# Altium schematic sheet OPAMP_TESTER_2.SchDoc: OPAMP_TESTER
size A4; CheckedBy: D.MOHAMMADI; DrawnBy: A.RAJABI; SheetNumber: 3; SheetTotal: 3
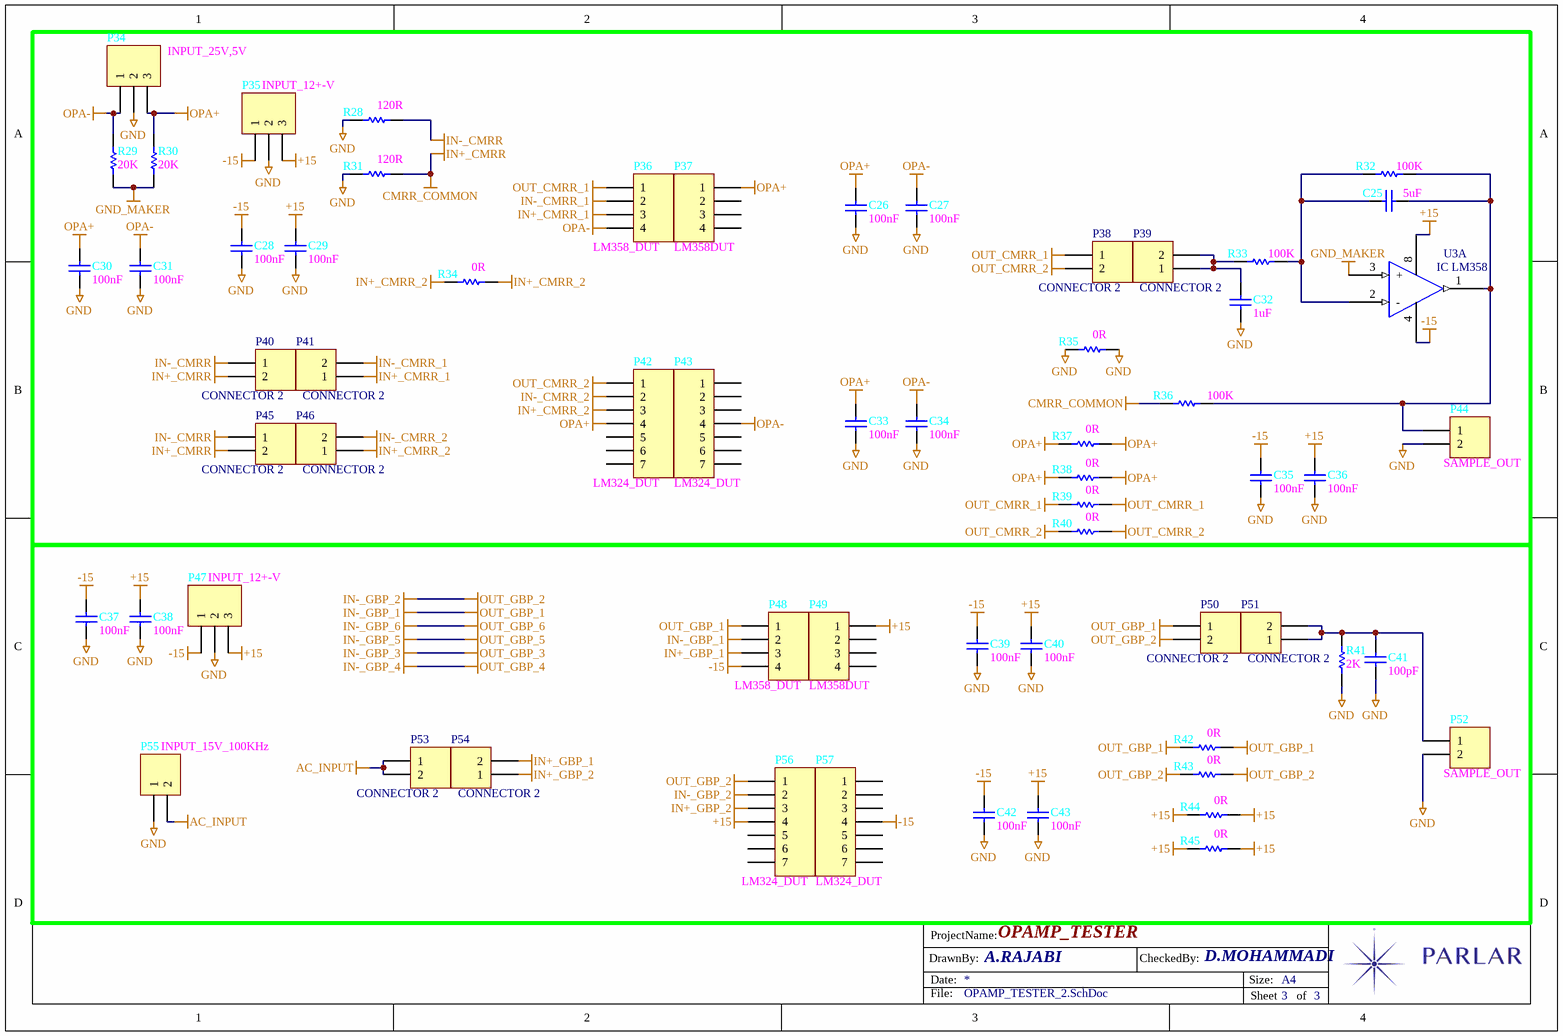
[diagram p0: OPAMP_TESTER_2.SchDoc]

## Parts
C25  5uF  [SMD 1206]
C26  100nF  [SMD 1206]
C27  100nF  [SMD 0805]
C28  100nF  [SMD 0805]
C29  100nF  [SMD 0805]
C30  100nF  [SMD 0805]
C31  100nF  [SMD 0805]
C32  1uF  [SMD 0805]
C33  100nF  [SMD 1206]
C34  100nF  [SMD 0805]
C35  100nF  [SMD 0805]
C36  100nF  [SMD 0805]
C37  100nF  [SMD 0805]
C38  100nF  [SMD 0805]
C39  100nF  [SMD 0805]
C40  100nF  [SMD 0805]
C41  100pF  [SMD 0805]
C42  100nF  [SMD 0805]
C43  100nF  [SMD 1206]
P34  INPUT_25V,5V  [CON XH 3]
P35  INPUT_12+-V  [CON XH 3]
P36  LM358_DUT  [CON HDR 2.54FM 4]
P37  LM358DUT  [CON HDR 2.54FM 4]
P38  CONNECTOR 2  [CON HDR 2.54M 2]
P39  CONNECTOR 2  [CON HDR 2.54M 2]
P40  CONNECTOR 2  [CON HDR 2.54M 2]
P41  CONNECTOR 2  [CON HDR 2.54M 2]
P42  LM324_DUT  [CON HDR 2.54FM 7]
P43  LM324_DUT  [CON HDR 2.54FM 7]
P44  SAMPLE_OUT  [CON XH 2]
P45  CONNECTOR 2  [CON HDR 2.54M 2]
P46  CONNECTOR 2  [CON HDR 2.54M 2]
P47  INPUT_12+-V  [CON XH 3]
P48  LM358_DUT  [CON HDR 2.54FM 4]
P49  LM358DUT  [CON HDR 2.54FM 4]
P50  CONNECTOR 2  [CON HDR 2.54M 2]
P51  CONNECTOR 2  [CON HDR 2.54M 2]
P52  SAMPLE_OUT  [CON XH 2]
P53  CONNECTOR 2  [CON HDR 2.54M 2]
P54  CONNECTOR 2  [CON HDR 2.54M 2]
P55  INPUT_15V_100KHz  [CON XH 2]
P56  LM324_DUT  [CON HDR 2.54FM 7]
P57  LM324_DUT  [CON HDR 2.54FM 7]
R28  120R  [SMD 0805]
R29  20K  [SMD 1206]
R30  20K  [SMD 0805]
R31  120R  [SMD 1206]
R32  100K  [SMD 0805]
R33  100K  [SMD 1206]
R34  0R  [SMD 1206]
R35  0R  [SMD 1206]
R36  100K  [SMD 1206]
R37  0R  [SMD 1206]
R38  0R  [SMD 1206]
R39  0R  [SMD 1206]
R40  0R  [SMD 1206]
R41  2K  [SMD 0805]
R42  0R  [SMD 1206]
R43  0R  [SMD 1206]
R44  0R  [SMD 1206]
R45  0R  [SMD 1206]
U3  IC LM358  [SMD IC SOP8]  (part A of 2)

## Nets
+15: C29.2 C36.2 C38.2 C40.2 C43.2 P35.3 P47.3 P49.1 P56.4 R44.1 R44.2 R45.1 R45.2 U3.8(VCC)
-15: C28.2 C35.2 C37.2 C39.2 C42.2 P35.1 P47.1 P48.4 P57.4 U3.4(GND)
AC_INPUT: P53.1 P53.2 P55.2
CMRR_COMMON: P40.2 P45.2 R31.2 R36.1  [also labelled IN+_CMRR]
GND: C26.1 C27.1 C28.1 C29.1 C30.1 C31.1 C32.1 C33.1 C34.1 C35.1 C36.1 C37.1 C38.1 C39.1 C40.1 C41.1 C42.1 C43.1 P34.2 P35.2 P44.2 P47.2 P52.2 P55.1 R28.1 R31.1 R35.1 R35.2 R41.2
GND_MAKER: R29.1 R30.1 U3.3(+)
IN+_CMRR_1: P36.3 P41.1
IN+_CMRR_2: P42.3 P46.1 R34.1 R34.2
IN+_GBP_1: P48.3 P54.2
IN+_GBP_2: P54.1 P56.3
IN-_CMRR: P40.1 P45.1 R28.2
IN-_CMRR_1: P36.2 P41.2
IN-_CMRR_2: P42.2 P46.2
IN-_GBP_1: P48.1 P48.2 P50.1 R42.1 R42.2  [also labelled OUT_GBP_1]
IN-_GBP_2: P50.2 P56.1 P56.2 R43.1 R43.2  [also labelled OUT_GBP_2]
OPA+: C26.2 C30.2 C33.2 P34.3 P37.1 P42.4 R30.2 R37.1 R37.2 R38.1 R38.2
OPA-: C27.2 C31.2 C34.2 P34.1 P36.4 P43.4 R29.2
OUT_CMRR_1: P36.1 P38.1 R39.1 R39.2
OUT_CMRR_2: P38.2 P42.1 R40.1 R40.2
NetC25_1: C25.1 P44.1 R32.2 R36.2 U3.1(OUT1)
NetC25_2: C25.2 R32.1 R33.2 U3.2(-)
NetC32_2: C32.2 P39.1 P39.2 R33.1
NetC41_2: C41.2 P51.1 P51.2 P52.1 R41.1

Not connected (* = marked no-connect by the designer): P37 2 3 4; P42 5 6 7; P43 1 2 3 5 6 7; P49 2 3 4; P56 5 6 7; P57 1 2 3 5 6 7

## Notes on the sheet
- DrawnBy:
- ProjectName:
- Date:
- CheckedBy:
- Size:
- A4
- File:
- Sheet
- of

## Library data of the parts
C25-C43 = CAP: Capacitor; Published: 8-Jun-2000; LatestRevisionDate: 17-Jul-2002; LatestRevisionNote: Re-released for DXP Platform.; PackageReference: RAD-0.3; Publisher: Altium Limited; PackageDescription: Radial Cap, Thru-Hole; 2 Leads; 0.3 in Pin Spacing
P34 P35 P47 = CONNECTOR 3: Header, 3-Pin; LatestRevisionDate: 17-Jul-2002; LatestRevisionNote: Re-released for DXP Platform.; Publisher: Altium Limited
P36 P37 P48 P49 = CONNECTOR 4: Header, 4-Pin; LatestRevisionDate: 17-Jul-2002; LatestRevisionNote: Re-released for DXP Platform.; Publisher: Altium Limited
P38-P41 P44-P46 P50-P55 = CONNECTOR 2: Header, 2-Pin; LatestRevisionDate: 17-Jul-2002; LatestRevisionNote: Re-released for DXP Platform.; Publisher: Altium Limited
P42 P43 P56 P57 = CONNECTOR 7: Header, 7-Pin; LatestRevisionDate: 17-Jul-2002; LatestRevisionNote: Re-released for DXP Platform.; Publisher: Altium Limited
R28-R45 = RES: Resistor